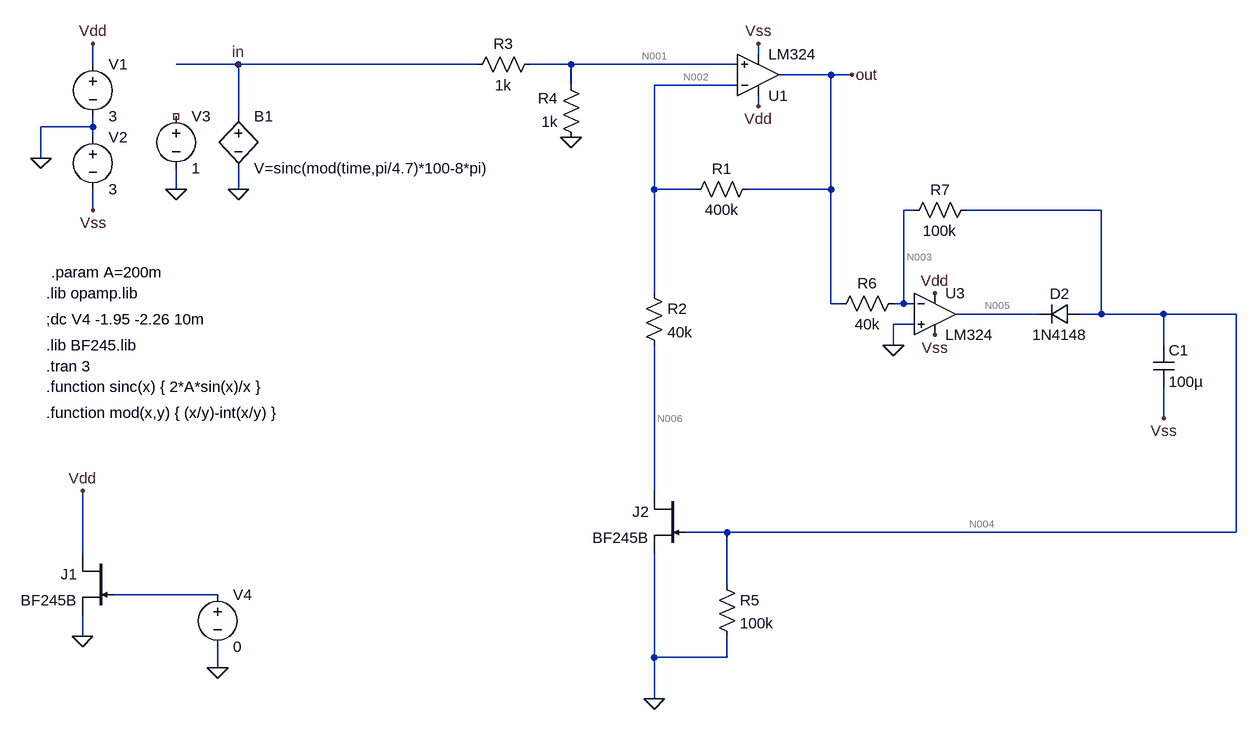
[diagram p0: schematic agc_9.asc]
agc_9.asc, the LTspice schematic file:
Version 4
SHEET 1 1464 940
WIRE 224 -176 224 -192
WIRE -800 -160 -800 -192
WIRE -576 -160 -672 -160
WIRE -208 -160 -576 -160
WIRE -64 -160 -128 -160
WIRE 192 -160 -64 -160
WIRE 336 -144 256 -144
WIRE 368 -144 336 -144
WIRE -64 -128 -64 -160
WIRE 192 -128 64 -128
WIRE 224 -96 224 -112
WIRE -576 -80 -576 -160
WIRE -800 -64 -800 -80
WIRE -800 -64 -880 -64
WIRE -800 -48 -800 -64
WIRE -880 -16 -880 -64
WIRE -672 32 -672 0
WIRE -576 32 -576 0
WIRE 64 32 64 -128
WIRE 128 32 64 32
WIRE 336 32 336 -144
WIRE 336 32 208 32
WIRE -800 64 -800 32
WIRE 464 64 448 64
WIRE 752 64 544 64
WIRE 64 192 64 32
WIRE 336 208 336 32
WIRE 352 208 336 208
WIRE 448 208 448 64
WIRE 448 208 432 208
WIRE 464 208 448 208
WIRE 656 224 528 224
WIRE 752 224 752 64
WIRE 752 224 720 224
WIRE 848 224 752 224
WIRE 960 224 848 224
WIRE 464 240 432 240
WIRE 432 272 432 240
WIRE 848 272 848 224
WIRE 848 384 848 336
WIRE 64 496 64 272
WIRE 176 560 112 560
WIRE 960 560 960 224
WIRE 960 560 176 560
WIRE -816 592 -816 496
WIRE 176 640 176 560
WIRE -608 656 -768 656
WIRE -816 720 -816 688
WIRE 64 752 64 592
WIRE 176 752 176 720
WIRE 176 752 64 752
WIRE -608 768 -608 736
WIRE 64 816 64 752
FLAG -880 -16 0
FLAG -800 -192 Vdd
FLAG 224 -96 Vdd
FLAG 224 -192 Vss
FLAG -800 64 Vss
FLAG -576 32 0
FLAG 368 -144 out
FLAG -576 -160 in
FLAG -816 720 0
FLAG -816 496 Vdd
FLAG -608 768 0
FLAG 496 256 Vss
FLAG 496 192 Vdd
FLAG 848 384 Vss
FLAG 64 816 0
FLAG -64 -48 0
FLAG 432 272 0
FLAG -672 32 0
SYMBOL voltage -800 -176 R0
SYMATTR InstName V1
SYMATTR Value 3
SYMBOL voltage -800 -64 R0
SYMATTR InstName V2
SYMATTR Value 3
SYMBOL res 224 16 R90
WINDOW 0 0 56 VBottom 2
WINDOW 3 32 56 VTop 2
SYMATTR InstName R1
SYMATTR Value 400k
SYMBOL njf -768 592 M0
SYMATTR InstName J1
SYMATTR Value BF245B
SYMBOL voltage -608 640 R0
SYMATTR InstName V4
SYMATTR Value 0
SYMBOL Opamps\\opamp2 224 -80 M180
SYMATTR InstName U1
SYMATTR Value LM324
SYMBOL Opamps\\opamp2 496 160 R0
SYMATTR InstName U3
SYMATTR Value LM324
SYMBOL diode 720 208 R90
WINDOW 0 0 32 VBottom 2
WINDOW 3 32 32 VTop 2
SYMATTR InstName D2
SYMATTR Value 1N4148
SYMBOL cap 832 272 R0
SYMATTR InstName C1
SYMATTR Value 100µ
SYMBOL njf 112 496 M0
SYMATTR InstName J2
SYMATTR Value BF245B
SYMBOL res 48 176 R0
SYMATTR InstName R2
SYMATTR Value 40k
SYMBOL res 160 624 R0
SYMATTR InstName R5
SYMATTR Value 100k
SYMBOL res -112 -176 R90
WINDOW 0 0 56 VBottom 2
WINDOW 3 32 56 VTop 2
SYMATTR InstName R3
SYMATTR Value 1k
SYMBOL res -48 -32 R180
WINDOW 0 36 76 Left 2
WINDOW 3 36 40 Left 2
SYMATTR InstName R4
SYMATTR Value 1k
SYMBOL bv -576 -96 R0
SYMATTR InstName B1
SYMATTR Value V=sinc(mod(time,pi/4.7)*100-8*pi)
SYMBOL res 448 192 R90
WINDOW 0 0 56 VBottom 2
WINDOW 3 32 56 VTop 2
SYMATTR InstName R6
SYMATTR Value 40k
SYMBOL res 560 48 R90
WINDOW 0 0 56 VBottom 2
WINDOW 3 32 56 VTop 2
SYMATTR InstName R7
SYMATTR Value 100k
SYMBOL voltage -672 -96 R0
SYMATTR InstName V3
SYMATTR Value 1
TEXT -872 232 Left 2 !;dc V4 -1.95 -2.26 10m
TEXT -872 192 Left 2 !.lib opamp.lib
TEXT -872 272 Left 2 !.lib BF245.lib
TEXT -872 304 Left 2 !.tran 3
TEXT -872 336 Left 2 !.function sinc(x) { 2*A*sin(x)/x }
TEXT -872 376 Left 2 !.function mod(x,y) { (x/y)-int(x/y) }
TEXT -864 160 Left 2 !.param A=200m

The netlist it stands for:
* agc_9.asc
V1 Vdd 0 3
V2 0 Vss 3
R1 out N002 400k
J1 Vdd N007 0 BF245B
V4 N007 0 0
XU1 N001 N002 Vdd Vss out LM324  ; pins In+ In- V+ V- OUT
XU3 0 N003 Vdd Vss N005 LM324  ; pins In+ In- V+ V- OUT
D2 N004 N005 1N4148
C1 N004 Vss 100µ
J2 N006 N004 0 BF245B
R2 N002 N006 40k
R5 N004 0 100k
R3 N001 in 1k
R4 0 N001 1k
B1 in 0 V=sinc(mod(time,pi/4.7)*100-8*pi)
R6 N003 out 40k
R7 N004 N003 100k
V3 NC_01 0 1
.model D D
.lib standard.dio
.model NJF NJF
.model PJF PJF
.lib standard.jft
;dc V4 -1.95 -2.26 10m
.lib opamp.lib
.lib BF245.lib
.tran 3
.function sinc(x) { 2*A*sin(x)/x }
.function mod(x,y) { (x/y)-int(x/y) }
.param A=200m
.backanno
.end

* Results of the author's LTspice run, read from the files saved beside the schematic
* Operating Point, zero values left out:
*   V(vdd) = 3 V
*   V(vss) = -3 V
*   V(out) = -19.84 mV
*   V(n002) = -169.9 µV
*   V(n001) = 22.37 µV
*   V(n005) = 2.316 V
*   V(n003) = -14.73 mV
*   V(n004) = -7.236 mV
*   V(n006) = -907.8 nV
*   I(B1) = 22.37 nA
*   I(D2) = -2.522 nA
*   Id(J2) = -4.226 nA
*   Is(J2) = 4.226 nA
*   Id(J1) = 5.956 mA
*   Ig(J1) = -3 pA
*   Is(J1) = -5.956 mA
*   I(R7) = 74.89 nA
*   I(R6) = 128 nA
*   I(R4) = -22.37 nA
*   I(R3) = 22.37 nA
*   I(R5) = -72.36 nA
*   I(R2) = -4.226 nA
*   I(R1) = -49.19 nA
*   I(V4) = 3 pA
*   I(V2) = -1.353 mA
*   I(V1) = -7.309 mA
*   Ix(u1:1) = -44.74 nA
*   Ix(u1:2) = -44.96 nA
*   Ix(u1:3) = 676.7 µA
*   Ix(u1:4) = -676.7 µA
*   Ix(u1:5) = 177.2 nA
*   Ix(u3:1) = -36.61 nA
*   Ix(u3:2) = -53.1 nA
*   Ix(u3:3) = 676 µA
*   Ix(u3:4) = -675.9 µA
*   Ix(u3:5) = -2.522 nA
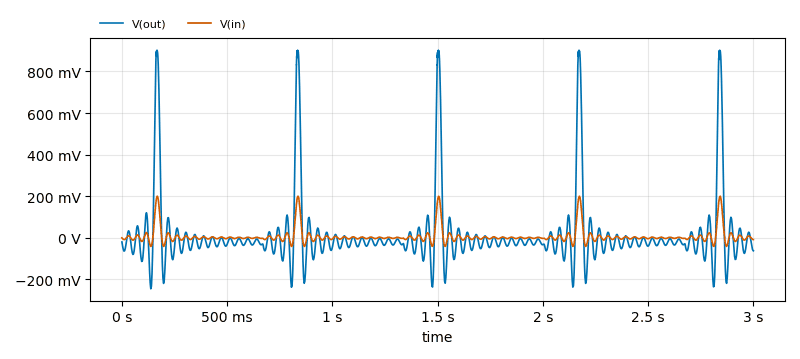
[diagram p1: Transient Analysis of agc_9.asc, plotted from the saved traces]
* Transient Analysis, 1 run:
*   V(out): min -244.8 mV, max 901 mV, average 13.96 mV, rms 177.2 mV, last -62.16 mV
*   V(in): min -41.35 mV, max 200 mV, average 7.008 mV, rms 37.14 mV, last -8.381 mV